# Altium schematic sheet GIO.SchDoc: ROBOX V2 - General Input Output
size A4; DrawnBy: Jan Stappers; DocumentNumber: JSP016; Revision: B; SheetNumber: 6; SheetTotal: 6
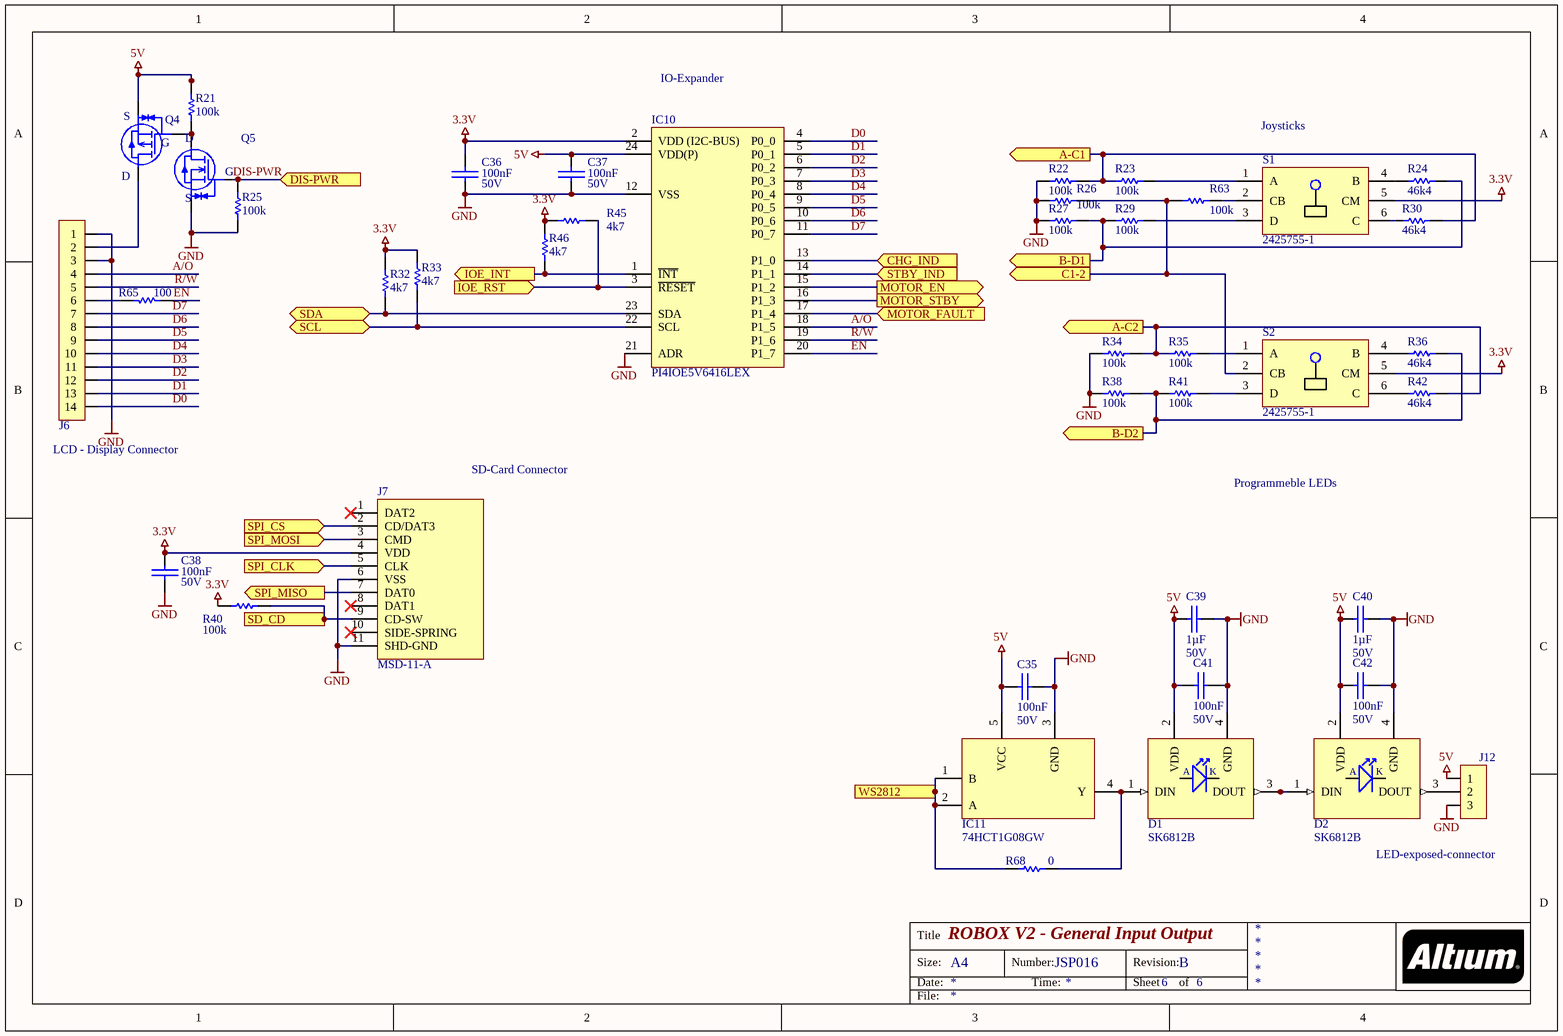
[diagram p0: GIO.SchDoc]

## Parts
C35  value 100nF  voltage: 50V  [TH5.08]  (hidden comment: cap_non_pol)
C36  value 100nF  voltage: 50V  [C0402]  (hidden comment: cap_non_pol)
C37  value 100nF  voltage: 50V  [C0402]  (hidden comment: cap_non_pol)
C38  value 100nF  voltage: 50V  [C0402]  (hidden comment: cap_non_pol)
C39  value 1µF  voltage: 50V  [TH5.08]  (hidden comment: cap_non_pol)
C40  value 1µF  voltage: 50V  [TH5.08]  (hidden comment: cap_non_pol)
C41  value 100nF  voltage: 50V  [TH5.08]  (hidden comment: cap_non_pol)
C42  value 100nF  voltage: 50V  [TH5.08]  (hidden comment: cap_non_pol)
D1  SK6812B  [SK6812B]
D2  SK6812B  [SK6812B]
IC10  PI4IOE5V6416LEX  [TSSOP-24]
IC11  74HCT1G08GW  [TSSOP-5]
J6  Pin-14  [HLW14S-2C7LF]  (value not drawn)
J7  MSD-11-A  [MSD-11-A]
J12  Pin-3  [3-PIN-EMPTY]  (value not drawn)
Q4  P_CH_MOSFET2  [SOT-323]  (value not drawn)
Q5  N_CH_MOSFET  [SOT-23(-3)]  (value not drawn)
R21  value 100k  [R0402]  (hidden comment: resistor)
R22  value 100k  [R0402]  (hidden comment: resistor)
R23  value 100k  [R0402]  (hidden comment: resistor)
R24  value 46k4  [R0402]  (hidden comment: resistor)
R25  value 100k  [R0402]  (hidden comment: resistor)
R26  value 100k  [R0402]  (hidden comment: resistor)
R27  value 100k  [R0402]  (hidden comment: resistor)
R29  value 100k  [R0402]  (hidden comment: resistor)
R30  value 46k4  [R0402]  (hidden comment: resistor)
R32  value 4k7  [R0402]  (hidden comment: resistor)
R33  value 4k7  [R0402]  (hidden comment: resistor)
R34  value 100k  [R0402]  (hidden comment: resistor)
R35  value 100k  [R0402]  (hidden comment: resistor)
R36  value 46k4  [R0402]  (hidden comment: resistor)
R38  value 100k  [R0402]  (hidden comment: resistor)
R40  value 100k  [R0402]  (hidden comment: resistor)
R41  value 100k  [R0402]  (hidden comment: resistor)
R42  value 46k4  [R0402]  (hidden comment: resistor)
R45  value 4k7  [R0402]  (hidden comment: resistor)
R46  value 4k7  [R0402]  (hidden comment: resistor)
R63  value 100k  [R0402]  (hidden comment: resistor)
R65  value 100  [R0402]  (hidden comment: resistor)
R68  value 0  [R0402]  (hidden comment: resistor)
S1  2425755-1  [2425755-1]
S2  2425755-1  [2425755-1]

## Ports
A-C1 (out), A-C2 (out), B-D1 (out), B-D2 (out), C1-2 (out), CHG_IND (in), DIS-PWR (in), IOE_INT (out), IOE_RST (in), MOTOR_EN (out), MOTOR_FAULT (in), MOTOR_STBY (out), SCL (bidir), SD_CD (out), SDA (bidir), SPI_CLK (in), SPI_CS (in), SPI_MISO (out), SPI_MOSI (in), STBY_IND (in), WS2812 (in)

## Nets
3.3V: C36.2 C38.2 IC10.2(VDD_(I2C-BUS)) J7.4(VDD) R32.2 R33.2 R40.2 R45.2 R46.2 S1.5(CM) S2.5(CM)
5V: C35.1 C37.2 C39.2 C40.2 C41.1 C42.1 D1.2(VDD) D2.2(VDD) IC10.24(VDD(P)) IC11.5(VCC) J12.1 Q4.S R21.1
GND: C35.2 C36.1 C37.1 C38.1 C39.1 C40.1 C41.2 C42.2 D1.4(GND) D2.4(GND) IC10.12(VSS) IC10.21(ADR) IC11.3(GND) J6.1 J6.3 J7.6(VSS) J7.11(SHD-GND) J12.3 Q5.2(S) R22.2 R25.2 R26.2 R27.2 R34.2 R38.2
A-C1: R22.1 R23.2 R30.1 ; port A-C1
A-C2: R34.1 R35.2 R42.1 ; port A-C2
A/O: IC10.18(P1_5) J6.4
B-D1: R24.1 R27.1 R29.2 ; port B-D1
B-D2: R36.1 R38.1 R41.2 ; port B-D2
C1-2: R26.1 R63.2 S2.2(CB) ; port C1-2
CHG_IND: IC10.13(P1_0) ; port CHG_IND
D0: IC10.4(P0_0) J6.14
D1: IC10.5(P0_1) J6.13
D2: IC10.6(P0_2) J6.12
D3: IC10.7(P0_3) J6.11
D4: IC10.8(P0_4) J6.10
D5: IC10.9(P0_5) J6.9
D6: IC10.10(P0_6) J6.8
D7: IC10.11(P0_7) J6.7
DIS-PWR: Q5.1(G) R25.1 ; port DIS-PWR
EN: IC10.20(P1_7) R65.2
IOE_INT: IC10.1(~{INT}) R46.1 ; port IOE_INT
IOE_RST: IC10.3(~{RESET}) R45.1 ; port IOE_RST
MOTOR_EN: IC10.15(P1_2) ; port MOTOR_EN
MOTOR_FAULT: IC10.17(P1_4) ; port MOTOR_FAULT
MOTOR_STBY: IC10.16(P1_3) ; port MOTOR_STBY
R/W: IC10.19(P1_6) J6.5
SCL: IC10.22(SCL) R33.1 ; port SCL
SD_CD: J7.9(CD-SW) R40.1 ; port SD_CD
SDA: IC10.23(SDA) R32.1 ; port SDA
SPI_CLK: J7.5(CLK) ; port SPI_CLK
SPI_CS: J7.2(CD/DAT3) ; port SPI_CS
SPI_MISO: J7.7(DAT0) ; port SPI_MISO
SPI_MOSI: J7.3(CMD) ; port SPI_MOSI
STBY_IND: IC10.14(P1_1) ; port STBY_IND
WS2812: IC11.1(B) IC11.2(A) R68.2 ; port WS2812
NetD1_1: D1.1(DIN) IC11.4(Y) R68.1
NetD1_3: D1.3(DOUT) D2.1(DIN)
NetD2_3: D2.3(DOUT) J12.2
NetJ6_2: J6.2 Q4.D
NetJ6_6: J6.6 R65.1
NetQ4_G: Q4.G Q5.3(D) R21.2
NetR23_1: R23.1 S1.1(A)
NetR24_2: R24.2 S1.4(B)
NetR29_1: R29.1 S1.3(D)
NetR30_2: R30.2 S1.6(C)
NetR35_1: R35.1 S2.1(A)
NetR36_2: R36.2 S2.4(B)
NetR41_1: R41.1 S2.3(D)
NetR42_2: R42.2 S2.6(C)
NetR63_1: R63.1 S1.2(CB)

Not connected (* = marked no-connect by the designer): J7 1(DAT2)* 8(DAT1)* 10(SIDE-SPRING)*

## Notes on the sheet
- IO-Expander
- (near S1) Joysticks
- (near J6) LCD - Display Connector
- SD-Card Connector
- Programmeble LEDs
- LED-exposed-connector
- Title
- Size:
- Date:
- A4
- Number:
- Time:
- Revision:
- Sheet
- of
- File:
- (in symbol 86) A; K

## Library data of the parts
C35 C41 C42 = 51: CAP CER TH 100nF X7R 50V; manufacturer_ref: C2761753; manufacturer: FH; id: 51; tolerance: 10%; dielectric: X7R; package: TH5.08; supplier_1: lcsc; supplier_1_partnumber: C385200; price: 0,0237; status: active
C36-C38 = 0: CAP CER 0.1UF 50V X5R 0402; manufacturer_ref: 490-16356-1-ND; manufacturer: Murata Electronics; id: 0; tolerance: 5%; dielectric: X5R; package: 0402; supplier_1: digikey; supplier_1_partnumber: 490-16356-1-ND; price: 0,00933; status: non stock
C39 C40 = 49: CAP CER TH 1µF X7R 50V; manufacturer_ref: CD1H105MC9BEF4E000; manufacturer: Dersonic; id: 49; tolerance: 20%; dielectric: X7R; package: TH5.08; supplier_1: lcsc; supplier_1_partnumber: C263189; price: 0,0235; status: active
D1 D2 = 86: ADDRESS LED DISCRETE RGB 4X2MM; manufacturer_ref: WS2812-SIDE; manufacturer: Adafruit Industries LLC; id: 86; type: ADDRESSABLE LED; package: SK6812B; supplier_1: digikey/mouser; supplier_1_partnumber: 1528-4691-ND/485-4691; price: 0,365; status: active
IC10 = 83: IC XPNDR 400KHZ I2C 24TSSOP; manufacturer: Diodes Incorporated; id: 83; manufacturer_ref: PI4IOE5V6416LEX; type: Wired (Expander); package: 24-TSSOP; supplier_1: digikey; supplier_1_partnumber: PI4IOE5V6416LEXDICT-ND; price: 0,869; status: active
IC11 = 95: IC GATE AND 1CH 2-INP 5TSSOP; manufacturer: Nexperia USA Inc.; id: 95; manufacturer_ref: 74HCT1G08GW; type: Logic Gate (AND); package: 5-TSSOP; supplier_1: digikey; supplier_1_partnumber: 1727-6053-1-ND; price: 0,269; status: active
J6 = 57: CONN FFC FPC VERT 14POS 1MM PCB; manufacturer: Amphenol ICC (FCI); id: 57; nbr_positions_total: 14; manufacturer_ref: HLW14S-2C7LF; package: Pin-14SR; supplier_1: digikey; supplier_1_partnumber: 609-1827-ND; price: 0,21; status: active
J7 = 56: MICRO SD CARD CONNECTOR, 8 POSIT; manufacturer: CUI Devices; id: 56; nbr_positions_total: 11; manufacturer_ref: MSD-11-A; package: µsd; supplier_1: digikey; supplier_1_partnumber: 2223-MSD-11-ACT-ND; status: active
J12 = 61: CONN TH solder pad; manufacturer_ref: 3-Pin TH; id: 61; nbr_positions_total: 3; package: Pin-3SR; price: 0; status: active
Q4 = 14: MOSFET P-CH 20V 820MA SOT323; manufacturer_ref: DMG1013UW-7; manufacturer: Diodes Incorporated; id: 14; current_rating: 0.820A; voltage_vgs_min: -0.5V; type: P channel; voltage_vds: 20V; package: SOT-323; supplier_1: digikey; supplier_1_partnumber: DMG1013UW-7DICT-ND; price: 0,06792; status: active
Q5 = 7: MOSFET N-CH 100V 170MA SOT23-3; manufacturer_ref: BSS123-7-F; manufacturer: Diodes Incorporated; id: 7; current_rating: 0.170A; voltage_vgs_min: 20V; type: N channel; voltage_vds: 100V; package: SOT23-3; supplier_1: digikey; supplier_1_partnumber: NTR4003NT1GOSCT-ND; price: 0,0395; status: active
R21-R23 R25-R27 R29 R34 R35 R38 R40 R41 R63 = 7: RES SMD 100K OHM 1% 1/10W 0402; manufacturer_ref: ERJ-2RKF1003X; manufacturer: Panasonic Electronic Components; id: 7; tolerance: 1%; power: 1/10W; package: 0402; supplier_1: digikey; supplier_1_partnumber: P100KLCT-ND; price: 0,00735; status: active
R24 R30 R36 R42 = 39: RES SMD 46.4K OHM 1% 1/16W 0402; manufacturer_ref: AC0402FR-0746K4L; manufacturer: Yageo; id: 39; tolerance: 1%; power: 1/16W; package: 0402; supplier_1: digikey; supplier_1_partnumber: 13-AC0402FR-0746K4LCT-ND; price: 0,00296; status: active
R32 R33 R45 R46 = 1: RES SMD 4.7K OHM 1% 1/10W 0402; manufacturer_ref: ERJ-2RKF4701X; manufacturer: Panasonic Electronic Components; id: 1; tolerance: 1%; power: 1/10W; package: 0402; supplier_1: digikey; supplier_1_partnumber: P4.70KLCT-ND; price: 0,00901; status: active
R65 = 29: RES SMD 100 OHM 1% 1/5W 0402; manufacturer_ref: CRCW0402100RFKEDHP; manufacturer: Vishay Dale; id: 29; tolerance: 1%; power: 1/5W; package: 0402; supplier_1: digikey; supplier_1_partnumber: 541-100YCT-ND; price: 0,01933; status: active
R68 = 8: RES SMD 0 OHM JUMPER 1/10W 0402; manufacturer_ref: ERJ-2GE0R00X; manufacturer: Panasonic Electronic Components; id: 8; tolerance: 1%; power: 1/10W; package: 0402; supplier_1: digikey; supplier_1_partnumber: P0.0JCT-ND; price: 0,00487; status: active
S1 S2 = 2: SWITCH NAVIGATION DGTL 50MA 12V; manufacturer: TE Connectivity; id: 2; manufacturer_ref: 2425755-1; package: 2425755-1; supplier_1: digikey; supplier_1_partnumber: 450-2425755-1CT-ND; price: 0,25000; status: active